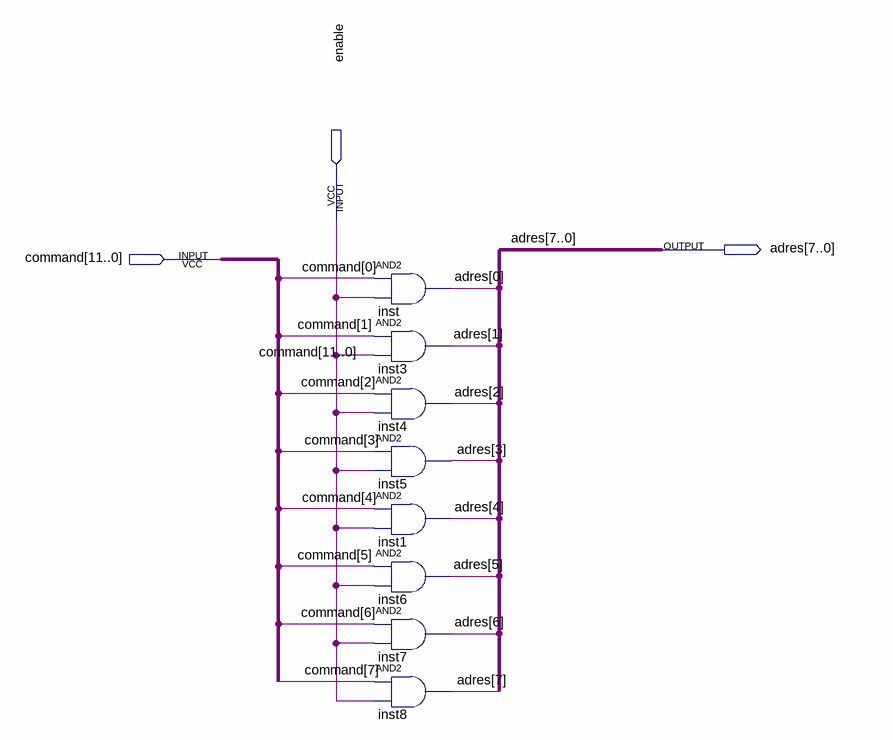
[diagram p0: schematic sheet]
// Quartus schematic adapter8x4.bdf as structural Verilog: 8 symbols, 3 pins
module adapter8x4 (
  input  enable,
  input  [11:0] command,
  output [7:0] adres
);

  and inst (adres[0], command[0], enable);
  and inst3 (adres[1], command[1], enable);
  and inst4 (adres[2], command[2], enable);
  and inst5 (adres[3], command[3], enable);
  and inst1 (adres[4], command[4], enable);
  and inst6 (adres[5], command[5], enable);
  and inst7 (adres[6], command[6], enable);
  and inst8 (adres[7], command[7], enable);
endmodule
